# EAGLE schematic nixie (EAGLE 9.1.1)

## Sheet 1 of 2
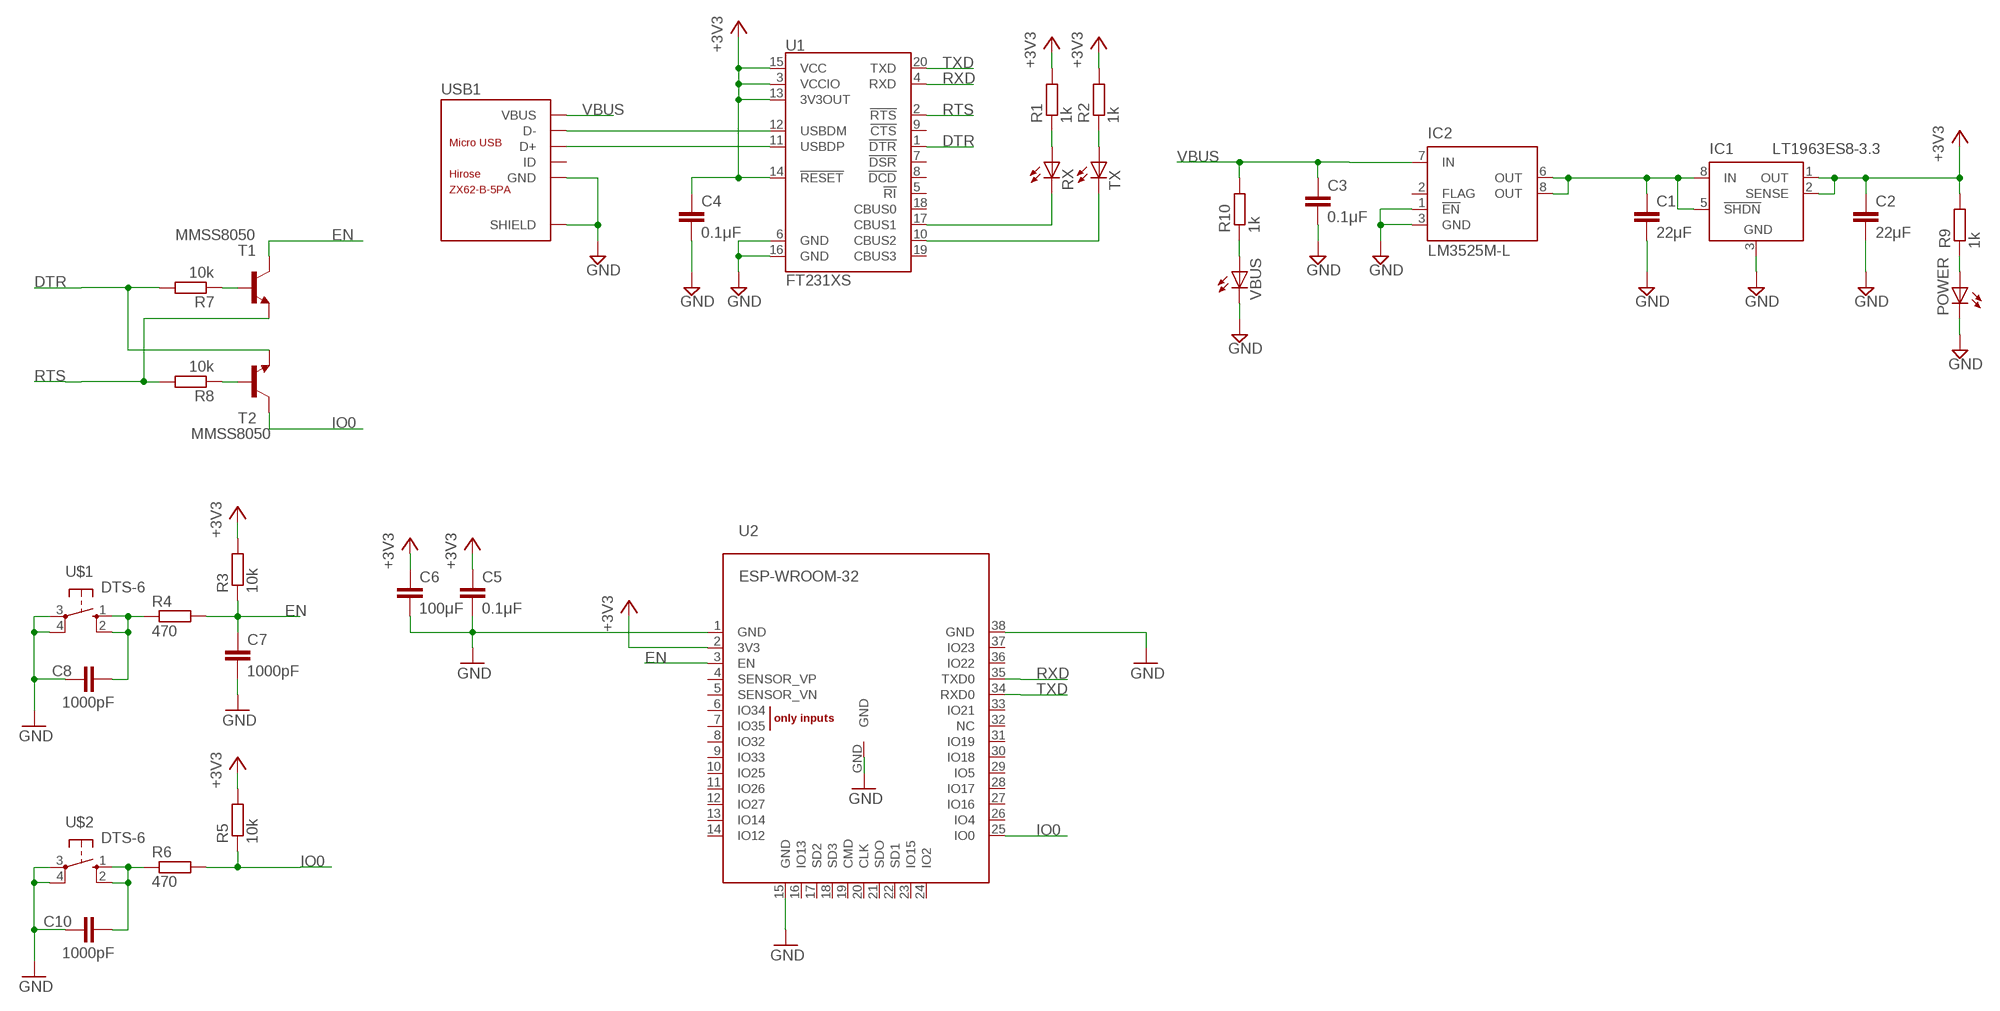
[diagram p0: schematic, sheet 1]

### Parts
C1  22μF  C-EUC2012  [C2012]
C2  22μF  C-EUC2012  [C2012]
C3  0.1μF  C-EUC0603  [C0603]
C4  0.1μF  C-EUC0603  [C0603]
C5  0.1μF  C-EUC0603  [C0603]
C6  100μF  C-EUC3225  [C3225]
C7  1000pF  C-EUC0603  [C0603]
C8  1000pF  C-EUC0603  [C0603]
C10  1000pF  C-EUC0603  [C0603]
IC1  LT1963ES8-3.3  [SOIC8]
IC2  LM3525M-L  [SO08]
POWER  LEDCHIP-LED0603  [CHIP-LED0603]
R1  1k  R-EU_R0603  [R0603]
R2  1k  R-EU_R0603  [R0603]
R3  10k  R-EU_R0603  [R0603]
R4  470  R-EU_R0603  [R0603]
R5  10k  R-EU_R0603  [R0603]
R6  470  R-EU_R0603  [R0603]
R7  10k  R-EU_R0603  [R0603]
R8  10k  R-EU_R0603  [R0603]
R9  1k  R-EU_R0603  [R0603]
R10  1k  R-EU_R0603  [R0603]
RX  LEDCHIP-LED0603  [CHIP-LED0603]
T1  MMSS8050  -NPN-SOT23-EBC  [SOT23-EBC]
T2  MMSS8050  -NPN-SOT23-EBC  [SOT23-EBC]
TX  LEDCHIP-LED0603  [CHIP-LED0603]
U1  FT231XS  [SSOP20_L]
U2  ESP-WROOM-32  [ESP-WROOM-32]
U$1  DTS-6  [DTS6]
U$2  DTS-6  [DTS6]
USB1  ZX62-B-5PA  MICRO-USB-SMD(ZX62-B-5PA)  [MICRO-USB5+6P-SMD-0.65-AB]
VBUS  LEDCHIP-LED0603  [CHIP-LED0603]

### Nets
+3V3: C2.1 C4.1 C5.1 C6.1 IC1.1(OUT) IC1.2(SENSE) R1.2 R2.2 R3.2 R5.2 R9.2 U1.3(VCCIO) U1.13(3V3OUT) U1.14(!RESET) U1.15(VCC) U2.2(3V3)
DTR: R7.2 T2.E U1.1(!DTR)
EN: C7.1 R3.1 R4.2 T1.C U2.3(EN)
GND: C1.2 C2.2 C3.2 C4.2 C5.2 C6.2 C7.2 C8.1 C10.1 IC1.3(GND) IC2.1(!EN) IC2.3(GND) POWER.C U1.6(GND) U1.16(GND) U2.1(GND) U2.15(GND) U2.38(GND) U2.GND U$1.3(P) U$1.4(P1) U$2.3(P) U$2.4(P1) USB1.5(GND) USB1.P1(SHIELD) USB1.P2(SHIELD) USB1.P3(SHIELD) USB1.P4(SHIELD) USB1.P5(SHIELD) USB1.P6(SHIELD) VBUS.C
IO0: R5.1 R6.2 T2.C U2.25(IO0)
N$1: C1.1 IC1.5(!SHDN) IC1.8(IN) IC2.6(OUT) IC2.8(OUT)
N$2: U1.12(USBDM) USB1.2(D-)
N$3: U1.11(USBDP) USB1.3(D+)
N$4: RX.C U1.17(CBUS1)
N$5: TX.C U1.10(CBUS2)
N$6: C8.2 R4.1 U$1.1(S) U$1.2(S1)
N$7: R1.1 RX.A
N$8: R2.1 TX.A
N$9: R7.1 T1.B
N$10: R8.1 T2.B
N$11: POWER.A R9.1
N$12: C10.2 R6.1 U$2.1(S) U$2.2(S1)
N$13: R10.1 VBUS.A
RTS: R8.2 T1.E U1.2(!RTS)
RXD: U1.4(RXD) U2.35(TXD0)
TXD: U1.20(TXD) U2.34(RXD0)
VBUS: C3.1 IC2.7(IN) R10.2 USB1.1(VBUS)
Unconnected: IC1.4(NC) IC2.2(FLAG) IC2.4(NC) IC2.5(NC) U1.5(!RI) U1.7(!DSR) U1.8(!DCD) U1.9(!CTS) U1.18(CBUS0) U1.19(CBUS3) U2.4(SENSOR_VP) U2.5(SENSOR_VN) U2.6(IO34) U2.7(IO35) U2.8(IO32) U2.9(IO33) U2.10(IO25) U2.11(IO26) U2.12(IO27) U2.13(IO14) U2.14(IO12) U2.16(IO13) U2.17(SD2) U2.18(SD3) U2.19(CMD) U2.20(CLK) U2.21(SDO) U2.22(SD1) U2.23(IO15) U2.24(IO2) U2.26(IO4) U2.27(IO16) U2.28(IO17) U2.29(IO5) U2.30(IO18) U2.31(IO19) U2.32(NC) U2.33(IO21) U2.36(IO22) U2.37(IO23) USB1.4(ID)

## Sheet 2 of 2

## Power pins joined to a net without a drawn wire
GND: IC1.6(GND) IC1.7(GND)

## Library data of the parts
C1 C2 C4-C8 C10 = resistor:C-EU: CAPACITOR, European symbol
C3 = rcl:C-EU: CAPACITOR, European symbol; SPICEPREFIX: C
IC1 = linear-technology:LT1963ES8: 1.5A, Low Noise, Fast Transient Response LDO Regulator Source: http://www.linear.com/pc/downloadDocument.do?navId=H0,C3,P2222,D3148; MPN: LT1963ES8-3.3; OC_FARNELL: unknown; OC_NEWARK: 57M7563
IC2 = linear:LM3525M-L: Single Port USB Power Switch and Over-Current Protection LOW active Source: http://cache.national.com/ds/LM/LM3525.pdf
POWER RX TX VBUS = led:LED: LED OSRAM: - CHIPLED LG R971, LG N971, LY N971, LG Q971, LY Q971, LO R971, LY R971 LH N974, LH R974 LS Q976, LO Q976, LY Q976 LO Q996 - Hyper CHIPLED LW Q18S LB Q993, LB Q99A, LB R99A - SideLED LS A670, LO A670, LY A670, LG A670, LP A670 LB A673, LV A673, LT A673, LW A673 LH A674 LY A675 LS A676, LA A676, LO A676, LY A676, LW A676 LS A679, LY A679, LG A679 - Hyper Micro SIDELED® LS Y876, LA Y876, LO Y876, LY Y876 LT Y87S - SmartLED LW L88C, LW L88S LB L89C, LB L89S, LG L890 LS L89K, LO L89K, LY L89K LS L896, LA L896, LO L896, LY L896 - TOPLED LS T670, LO T670, LY T670, LG T670, LP T670 LSG T670, LSP T670, LSY T670, LOP T670, LYG T670 LG T671, LOG T671, LSG T671 LB T673, LV T673, LT T673, LW T673 LH T674 LS T676, LA T676, LO T676, LY T676, LB T676, LH T676, LSB T676, LW T676 LB T67C, LV T67C, LT T67C, LS T67K, LO T67K, LY T67K, LW E67C LS E67B, LA E67B, LO E67B, LY E67B, LB E67C, LV E67C, LT E67C LW T67C LS T679, LY T679, LG T679 LS T770, LO T770, LY T770, LG T770, LP T770 LB T773, LV T773, LT T773, LW T773 LH T774 LS E675, LA E675, LY E675, LS T675 LS T776, LA T776, LO T776, LY T776, LB T776 LHGB T686 LT T68C, LB T68C - Hyper Mini TOPLED® LB M676 - Mini TOPLED Santana® LG M470 LS M47K, LO M47K, LY M47K Source: http://www.osram.convergy.de LUXEON: - LUMILED® LXK2-PW12-R00, LXK2-PW12-S00, LXK2-PW14-U00, LXK2-PW14-V00 LXK2-PM12-R00, LXK2-PM12-S00, LXK2-PM14-U00 LXK2-PE12-Q00, LXK2-PE12-R00, LXK2-PE12-S00, LXK2-PE14-T00, LXK2-PE14-U00 LXK2-PB12-K00, LXK2-PB12-L00, LXK2-PB12-M00, LXK2-PB14-N00, LXK2-PB14-P00, LXK2-PB14-Q00 LXK2-PR12-L00, LXK2-PR12-M00, LXK2-PR14-Q00, LXK2-PR14-R00 LXK2-PD12-Q00, LXK2-PD12-R00, LXK2-PD12-S00 LXK2-PH12-R00, LXK2-PH12-S00 LXK2-PL12-P00, LXK2-PL12-Q00, LXK2-PL12-R00 Source: www.luxeon.com KINGBRIGHT: KA-3528ASYC Source: www.kingbright.com
R1-R10 = resistor:R-EU_: RESISTOR, European symbol
T1 T2 = transistor-neu-to92:*-NPN-: NPN Transistror
U1 = SparkFun-IC-Comms:FT231X: FTDI FT231X Full Speed USB to Full-handshake UART This USB2.0 Full Speed IC offers a compact bridge to full handshake UART interfaces. The device is a UART, capable of operating up to 3MBaud, with low power consumption (8mA). The FT231X includes the complete FT-X series feature set and enables USB to be added into a system design quickly and easily over a UART interface. Datasheet <http://cdn.sparkfun.com/datasheets/Components/General%20IC/DS_FT231X.pdf> SparkFun Products SparkFun RedBoard - Programmed with Arduino <https://www.sparkfun.com/products/12757> (DEV-12757) SparkFun XBee Explorer USB <https://www.sparkfun.com/products/11812> (WRL-11812) SparkFun XBee Explorer Dongle <https://www.sparkfun.com/products/11697> (WRL-11697) SparkFun Blynk Board - ESP8266 <https://www.sparkfun.com/products/13794> (WRL-13794) SparkFun ESP8266 Thing - Dev Board <https://www.sparkfun.com/products/13711> (WRL-13711) SparkFun Block for Intel® Edison - Base <https://www.sparkfun.com/products/13045> (DEV-13045) SparkFun RedStick <https://www.sparkfun.com/products/13741> (DEV-13741) SparkFun Beefy 3 - FTDI Basic Breakout <https://www.sparkfun.com/products/13746> (DEV-13746) SparkFun FT231X Breakout <https://www.sparkfun.com/products/11736> (BOB-11736); PROD_ID: IC-11524
U2 = esp32:ESP-WROOM-32
U$1 U$2 = 180118 Library by matsu:DTS-6: AKIZUKIDENSHI, Cosland Co,. Ltd. TACT SWITCH DTS-6 http://akizukidenshi.com/download/ds/cosland/DTS-6-V.PDF
USB1 = Seeed-Connector:MICRO-USB-SMD(ZX62-B-5PA): 320010005; MPN: ZX62-B-5PA